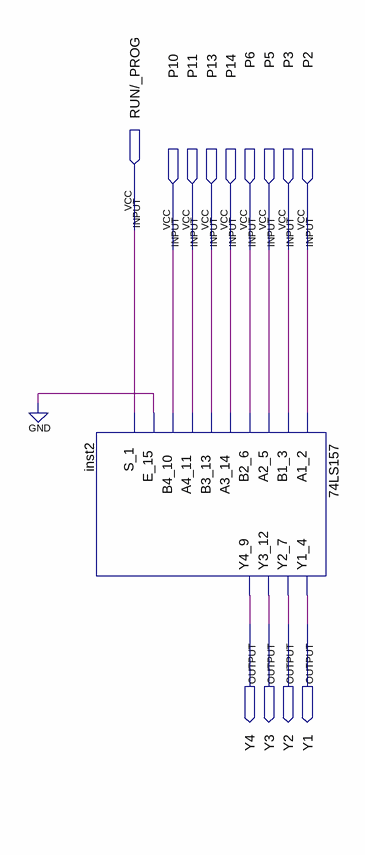
[diagram p0: schematic sheet]
// Quartus schematic ControladorSequenciador.bdf as structural Verilog: 1 symbols, 13 pins
module ControladorSequenciador (
  input  \RUN/_PROG ,
  input  P10,
  input  P11,
  input  P13,
  input  P14,
  input  P6,
  input  P5,
  input  P3,
  input  P2,
  output Y4,
  output Y3,
  output Y2,
  output Y1
);

  \74LS157  inst2 (
    .A1_2(P2), .B1_3(P3), .A2_5(P5), .B2_6(P6), .A3_14(P14), .B3_13(P13), .A4_11(P11), .B4_10(P10),
    .E_15(1'b0), .S_1(\RUN/_PROG ), .Y1_4(Y1), .Y2_7(Y2), .Y3_12(Y3), .Y4_9(Y4));
endmodule
